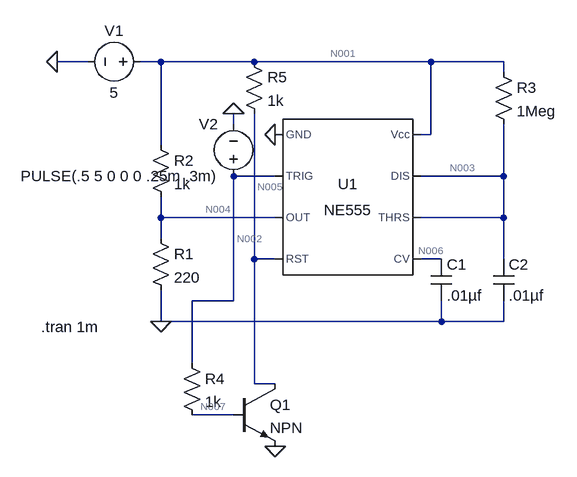
[diagram p0: schematic bistableclock.asc]
bistableclock.asc, the LTspice schematic file:
Version 4
SHEET 1 880 680
WIRE -176 -48 -224 -48
WIRE -64 -48 -96 -48
WIRE 80 -48 -64 -48
WIRE 352 -48 80 -48
WIRE 464 -48 352 -48
WIRE 464 -32 464 -48
WIRE 48 48 48 32
WIRE 352 64 352 -48
WIRE 352 64 336 64
WIRE -64 80 -64 -48
WIRE 112 128 48 128
WIRE 464 128 464 48
WIRE 464 128 336 128
WIRE -64 192 -64 160
WIRE 112 192 -64 192
WIRE 464 192 464 128
WIRE 464 192 336 192
WIRE -64 224 -64 192
WIRE 80 256 80 32
WIRE 112 256 80 256
WIRE 368 256 336 256
WIRE 464 256 464 192
WIRE 48 320 48 128
WIRE 48 320 -16 320
WIRE -64 352 -64 304
WIRE 368 352 368 320
WIRE 368 352 -64 352
WIRE 464 352 464 320
WIRE 464 352 368 352
WIRE -16 416 -16 320
WIRE 80 448 80 256
WIRE 112 448 80 448
WIRE 48 496 -16 496
FLAG 112 64 0
FLAG -224 -48 0
FLAG -64 352 0
FLAG 112 544 0
FLAG 48 32 0
SYMBOL Misc\\NE555 224 160 R0
SYMATTR InstName U1
SYMBOL cap 352 256 R0
SYMATTR InstName C1
SYMATTR Value .01µf
SYMBOL res -80 208 R0
SYMATTR InstName R1
SYMATTR Value 220
SYMBOL res -80 64 R0
SYMATTR InstName R2
SYMATTR Value 1k
SYMBOL res 448 -48 R0
SYMATTR InstName R3
SYMATTR Value 1Meg
SYMBOL cap 448 256 R0
SYMATTR InstName C2
SYMATTR Value .01µf
SYMBOL voltage -80 -48 R90
WINDOW 0 -32 56 VBottom 2
WINDOW 3 32 56 VTop 2
WINDOW 123 0 0 Left 2
WINDOW 39 0 0 Left 2
SYMATTR InstName V1
SYMATTR Value 5
SYMBOL voltage 48 144 R180
WINDOW 0 24 96 Left 2
WINDOW 3 24 16 Left 2
WINDOW 123 0 0 Left 2
WINDOW 39 0 0 Left 2
SYMATTR InstName V2
SYMATTR Value PULSE(.5 5 0 0 0 .25m .3m)
SYMBOL npn 48 448 R0
SYMATTR InstName Q1
SYMBOL res -32 400 R0
SYMATTR InstName R4
SYMATTR Value 1k
SYMBOL res 64 -64 R0
SYMATTR InstName R5
SYMATTR Value 1k
TEXT -248 360 Left 2 !.tran 1m

The netlist it stands for:
* bistableclock.asc
XU1 0 N002 N004 N005 N006 N003 N003 N001 NE555  ; pins GND TRIG OUT RST CV THRS DIS Vcc
C1 N006 0 .01µf
R1 N004 0 220
R2 N001 N004 1k
R3 N001 N003 1Meg
C2 N003 0 .01µf
V1 N001 0 5
V2 N002 0 PULSE(.5 5 0 0 0 .25m .3m)
Q1 N005 N007 0 0 NPN
R4 N002 N007 1k
R5 N001 N005 1k
.model NPN NPN
.model PNP PNP
.lib standard.bjt
.tran 1m
.lib NE555.sub
.backanno
.end

* Results of the author's LTspice run, read from the files saved beside the schematic
* Operating Point, zero values left out:
*   V(n002) = 500 mV
*   V(n006) = 3.333 V
*   V(n001) = 5 V
*   V(n003) = 4.988 V
*   V(n004) = 4.868 V
*   V(n005) = 4.978 V
*   V(n007) = 500 mV
*   Ic(Q1) = 24.86 nA
*   Ib(Q1) = 244.6 pA
*   Ie(Q1) = -25.1 nA
*   I(R5) = 22.17 µA
*   I(R4) = 244.6 pA
*   I(R3) = 11.64 nA
*   I(R2) = 132 µA
*   I(R1) = 22.13 mA
*   I(V2) = -744.6 pA
*   I(V1) = -23.74 mA
*   Ix(u1:1) = -1.611 mA
*   Ix(u1:2) = 500 pA
*   Ix(u1:3) = -22 mA
*   Ix(u1:4) = 22.14 µA
*   Ix(u1:6) = 4.988 nA
*   Ix(u1:7) = 6.656 nA
*   Ix(u1:8) = 23.58 mA
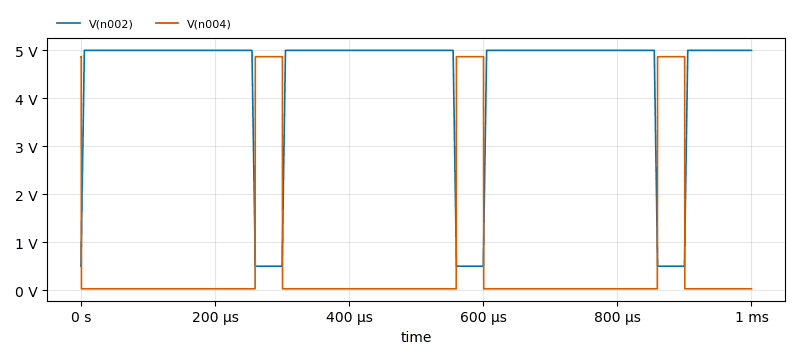
[diagram p1: Transient Analysis of bistableclock.asc, plotted from the saved traces]
* Transient Analysis, 1 run:
*   V(n002): min 500 mV, max 5 V, average 4.381 V, rms 4.635 V, last 5 V
*   V(n004): min 29.06 mV, max 4.868 V, average 623 mV, rms 1.705 V, last 29.06 mV